# EAGLE schematic alte_schaltung (EAGLE 6.5.0)
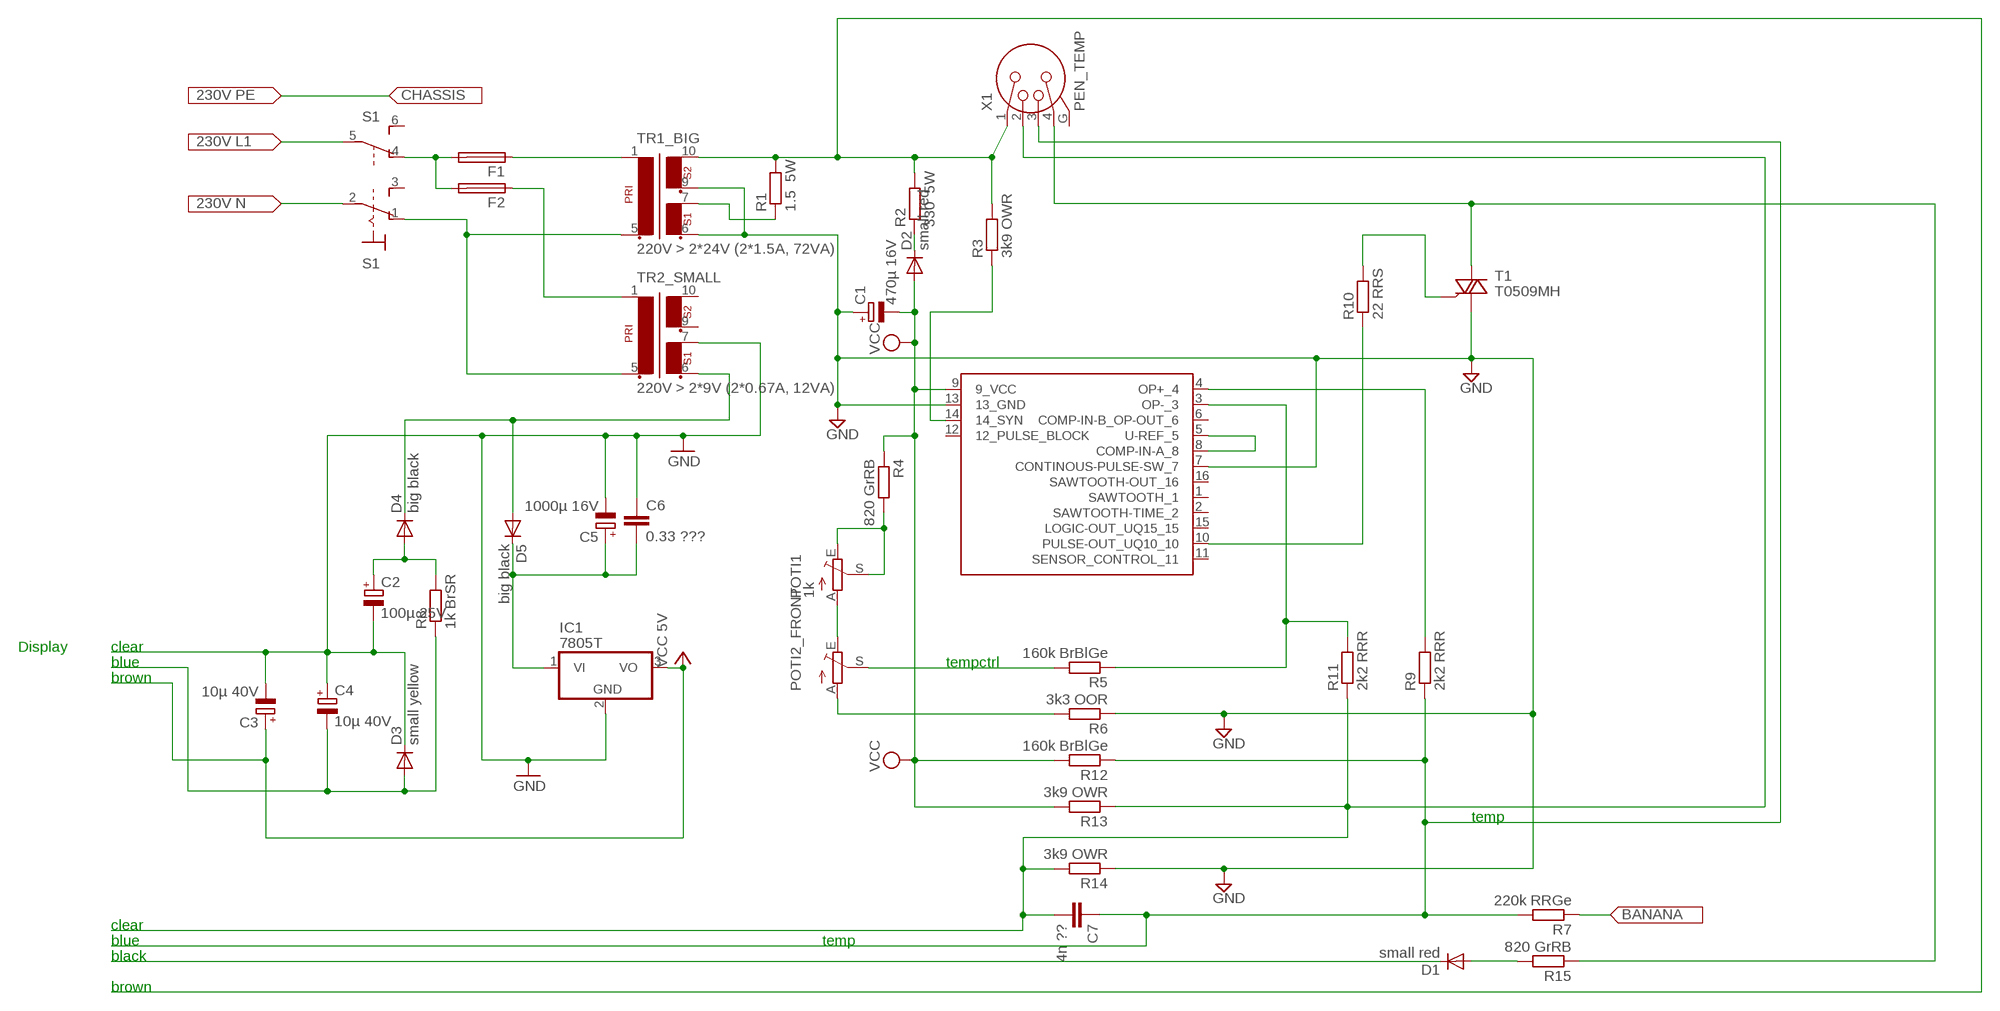
[diagram p0: schematic, sheet 1]

## Parts
C1  470µ 16V  CPOL-EUE5-10.5  [E5-10,5]
C2  100µ 25V  CPOL-EUE5-10.5  [E5-10,5]
C3  10µ 40V  CPOL-EUE5-10.5  [E5-10,5]
C4  10µ 40V  CPOL-EUE5-10.5  [E5-10,5]
C5  1000µ 16V  CPOL-EUE5-10.5  [E5-10,5]
C6  0.33 ???  C-EU075-042X103  [C075-042X103]
C7  4n ??  C-EU050-024X044  [C050-024X044]
D1  small red  1N4004  [DO41-10]
D2  small red  1N4004  [DO41-10]
D3  small yellow  1N4446  [DO35-10]
D4  big black  1N4942  [DO41-10]
D5  big black  1N4942  [DO41-10]
F1  SH25  [SH25]
F2  SH25  [SH25]
IC1  7805T  [TO220H]
POTI1  1k  TRIM_EU-LI10  [LI10]
POTI2_FRONT  TRIM_EU-RJ9W  [RJ9W]
R1  1.5 5W  R-EU_0922/22  [0922/22]
R2  330 5W  R-EU_0922/22  [0922/22]
R3  3k9 OWR  R-EU_0207/12  [0207/12]
R4  820 GrRB  R-EU_0207/12  [0207/12]
R5  160k BrBlGe  R-EU_0207/12  [0207/12]
R6  3k3 OOR  R-EU_0207/12  [0207/12]
R7  220k RRGe  R-EU_0207/12  [0207/12]
R8  1k BrSR  R-EU_0207/12  [0207/12]
R9  2k2 RRR  R-EU_0207/12  [0207/12]
R10  22 RRS  R-EU_0207/12  [0207/12]
R11  2k2 RRR  R-EU_0207/12  [0207/12]
R12  160k BrBlGe  R-EU_0207/12  [0207/12]
R13  3k9 OWR  R-EU_0207/12  [0207/12]
R14  3k9 OWR  R-EU_0207/12  [0207/12]
R15  820 GrRB  R-EU_0207/12  [0207/12]
S1  320-938  [320-938]
T1  T0509MH  BT136  [TO220AB]
TR1_BIG  220V > 2*24V (2*1.5A, 72VA)  EI42-2  [EI42-2]
TR2_SMALL  220V > 2*9V (2*0.67A, 12VA)  EI42-2  [EI42-2]
U$1  U106BS-DIL16  [DIL16]
X1  PEN_TEMP  NC4FBV  [NC4FBV]

## Nets
GND: C1.+ C2.- C3.- C4.+ C5.- C6.1 D3.C IC1.2(GND) R6.1 R14.1 T1.1(A1) TR1_BIG.6 TR1_BIG.9 TR2_SMALL.7 U$1.7(CONTINOUS-PULSE-SW_7) U$1.13(13_GND)
N$2: S1.5(B:P)
N$3: S1.2(1:P)
N$4: F1.2 F2.2 S1.4(B:O)
N$5: F1.1 TR1_BIG.1
N$6: F2.1 TR2_SMALL.1
N$7: S1.1(1:O) TR1_BIG.5 TR2_SMALL.5
N$9: R1.2 R2.2 R3.2 TR1_BIG.10 X1.1
N$10: R1.1 TR1_BIG.7
N$11: D4.C D5.A TR2_SMALL.6
N$12: C2.+ D4.A R8.2
N$13: C5.+ C6.2 D5.C IC1.1(VI)
N$14: C4.- D3.A R8.1
N$15: D1.A R15.2
N$16: R9.2 U$1.4(OP+_4)
N$17: C7.1 R7.2 R9.1 R12.1 X1.3
N$18: D1.C
N$19: POTI2_FRONT.S R5.2
N$20: C7.2 R11.1 R13.1 R14.2 X1.2
N$21: POTI2_FRONT.A R6.2
N$22: R15.1 T1.2(A2) X1.4
N$23: R5.1 R11.2 U$1.3(OP-_3)
N$24: D2.C R2.1
N$26: POTI1.A POTI2_FRONT.E
N$27: POTI1.E POTI1.S R4.2
N$28: R10.2 T1.3(G)
N$29: R10.1 U$1.10(PULSE-OUT_UQ10_10)
N$30: R7.1
N$31: U$1.5(U-REF_5) U$1.8(COMP-IN-A_8)
N$32: R3.1 U$1.14(14_SYN)
VCC: C1.- C3.+ D2.A IC1.3(VO) R4.1 R12.2 R13.2 U$1.9(9_VCC) ; supply symbol labelled VCC 5V
Unconnected: S1.3(1:S) S1.6(B:S) TR2_SMALL.9 TR2_SMALL.10 U$1.1(SAWTOOTH_1) U$1.2(SAWTOOTH-TIME_2) U$1.6(COMP-IN-B_OP-OUT_6) U$1.11(SENSOR_CONTROL_11) U$1.12(12_PULSE_BLOCK) U$1.15(LOGIC-OUT_UQ15_15) U$1.16(SAWTOOTH-OUT_16) X1.G

## Notes on the sheet
- Display | clear
- blue | tempctrl
- brown
- temp
- clear
- blue | temp
- black
- brown

## Library data of the parts
C1-C5 = rcl:CPOL-EU: POLARIZED CAPACITOR, European symbol
C6 C7 = rcl:C-EU: CAPACITOR, European symbol
D1 D2 = diode:1N4004: DIODE general purpose rectifier, 1 A
D3 = diode:1N4446: DIODE high speed (Philips)
D4 D5 = diode:1N4942: DIODE 1.0 A, 200 V, 150 ns
F1 F2 = fuse:SH25: FUSE HOLDER grid 25 mm, OGN0031 8211, Schurter (Buerklin); MF: SCHURTER; MPN: 0031.8211; OC_FARNELL: 1162741; OC_NEWARK: 96B9380
IC1 = linear:78*: Positive VOLTAGE REGULATOR Source: http://cache.national.com/ds/LM/LM78L05.pdf http://www.fairchildsemi.com/ds/LM/LM7805.pdf
POTI1 POTI2_FRONT = pot:TRIM_EU-: POTENTIOMETER
R1-R15 = resistor:R-EU_: RESISTOR, European symbol
S1 = switch:320-938: TOGGLE SWITCH distributor RS Components
T1 = triac:BT136: Triac BT136 series E sensitive gate Source: http://www.nxp.com/acrobat_download/datasheets/BT136_SERIES_E_2.pdf
TR1_BIG TR2_SMALL = trafo:EI42-2: TRANSFORMER 1 primary winding, 2 secondary windings ERA
U$1 = U106BS:U106BS-DIL16
X1 = con-neutrik_ag:NC4: Neutrik Audio Connector XLR SERIES Stereo 1/4" jack Source: www.neutrik.com/; MPN: NC4FBV; OC_FARNELL: unknown; OC_NEWARK: 10J0667